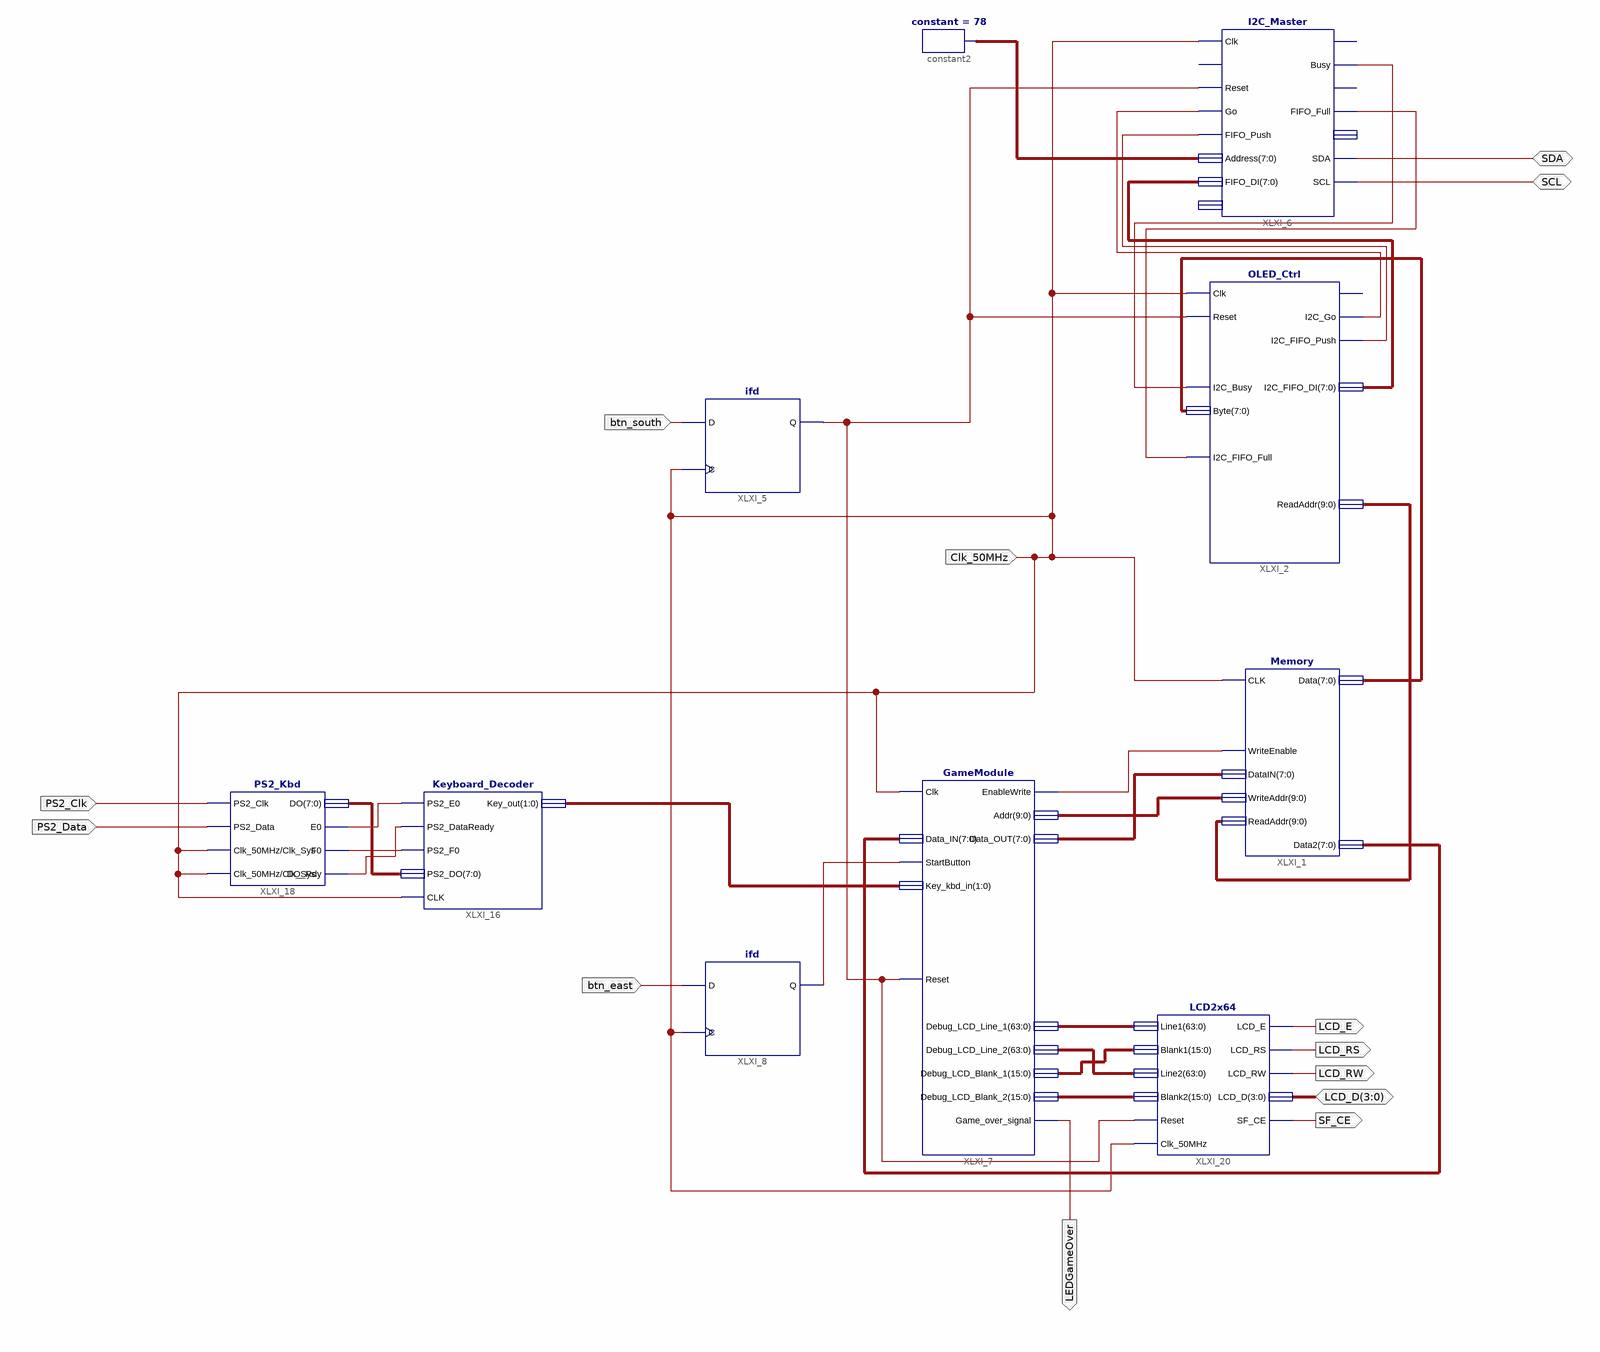
[diagram p0: schematic sheet 1]
// Xilinx ISE schematic schemat.sch (spartan3e) as structural Verilog: 10 symbols, 13 ports
module schemat (
  input  btn_south,
  input  Clk_50MHz,
  input  btn_east,
  input  PS2_Clk,
  input  PS2_Data,
  inout  SDA,
  inout  SCL,
  inout  [3:0] LCD_D,
  output LCD_E,
  output LCD_RS,
  output LCD_RW,
  output SF_CE,
  output LEDGameOver
);

  wire BUSY, FIFO_FULL, FIFO_PUSH, GO, Reset, XLXN_36, XLXN_38, XLXN_69, XLXN_70, XLXN_72;
  wire [1:0] XLXN_74;
  wire [7:0] \const , DATA, FIFO_DI, XLXN_27, XLXN_30, XLXN_68;
  wire [9:0] XLXN_13, XLXN_37;
  wire [15:0] XLXN_77, XLXN_78;
  wire [63:0] XLXN_75, XLXN_76;

  OLED_Ctrl XLXI_2 (
    .Clk(Clk_50MHz), .Reset(Reset), .I2C_FIFO_Full(FIFO_FULL), .I2C_Busy(BUSY), .Byte(DATA), .I2C_Go(GO),
    .I2C_FIFO_Push(FIFO_PUSH), .I2C_FIFO_DI(FIFO_DI), .ReadAddr(XLXN_13));  // open: Busy
  constant #(.CValue("78")) constant2 (.O(\const ));
  I2C_Master XLXI_6 (
    .Clk(Clk_50MHz), .Reset(Reset), .Go(GO), .FIFO_Push(FIFO_PUSH), .Address(\const ), .FIFO_DI(FIFO_DI),
    .Busy(BUSY), .FIFO_Full(FIFO_FULL), .SDA(SDA), .SCL(SCL));  // open: FIFO_Pop, ReadCnt, NACK, FIFO_Empty, FIFO_DO
  Memory XLXI_1 (
    .WriteEnable(XLXN_36), .CLK(Clk_50MHz), .WriteAddr(XLXN_37), .ReadAddr(XLXN_13), .DataIN(XLXN_27),
    .Data(DATA), .Data2(XLXN_30));
  GameModule XLXI_7 (
    .Clk(Clk_50MHz), .StartButton(XLXN_38), .Reset(Reset), .Data_IN(XLXN_30), .Key_kbd_in(XLXN_74),
    .EnableWrite(XLXN_36), .Game_over_signal(LEDGameOver), .Addr(XLXN_37), .Data_OUT(XLXN_27),
    .Debug_LCD_Line_1(XLXN_75), .Debug_LCD_Blank_1(XLXN_77), .Debug_LCD_Line_2(XLXN_76),
    .Debug_LCD_Blank_2(XLXN_78));
  ifd XLXI_8 (.C(Clk_50MHz), .D(btn_east), .Q(XLXN_38));
  ifd XLXI_5 (.C(Clk_50MHz), .D(btn_south), .Q(Reset));
  Keyboard_Decoder XLXI_16 (
    .PS2_E0(XLXN_69), .PS2_DataReady(XLXN_72), .PS2_F0(XLXN_70), .CLK(Clk_50MHz), .PS2_DO(XLXN_68),
    .Key_out(XLXN_74));
  PS2_Kbd XLXI_18 (
    .PS2_Clk(PS2_Clk), .PS2_Data(PS2_Data), .Clk_50MHz(Clk_50MHz), .E0(XLXN_69), .F0(XLXN_70),
    .DO_Rdy(XLXN_72), .DO(XLXN_68), .Clk_Sys(Clk_50MHz));
  LCD2x64 XLXI_20 (
    .Line1(XLXN_75), .Blank1(XLXN_77), .Line2(XLXN_76), .Blank2(XLXN_78), .LCD_D(LCD_D), .LCD_E(LCD_E),
    .LCD_RW(LCD_RW), .LCD_RS(LCD_RS), .SF_CE(SF_CE), .Reset(Reset), .Clk_50MHz(Clk_50MHz));
endmodule
